# Altium schematic sheet 电源小板.SchDoc
size A4
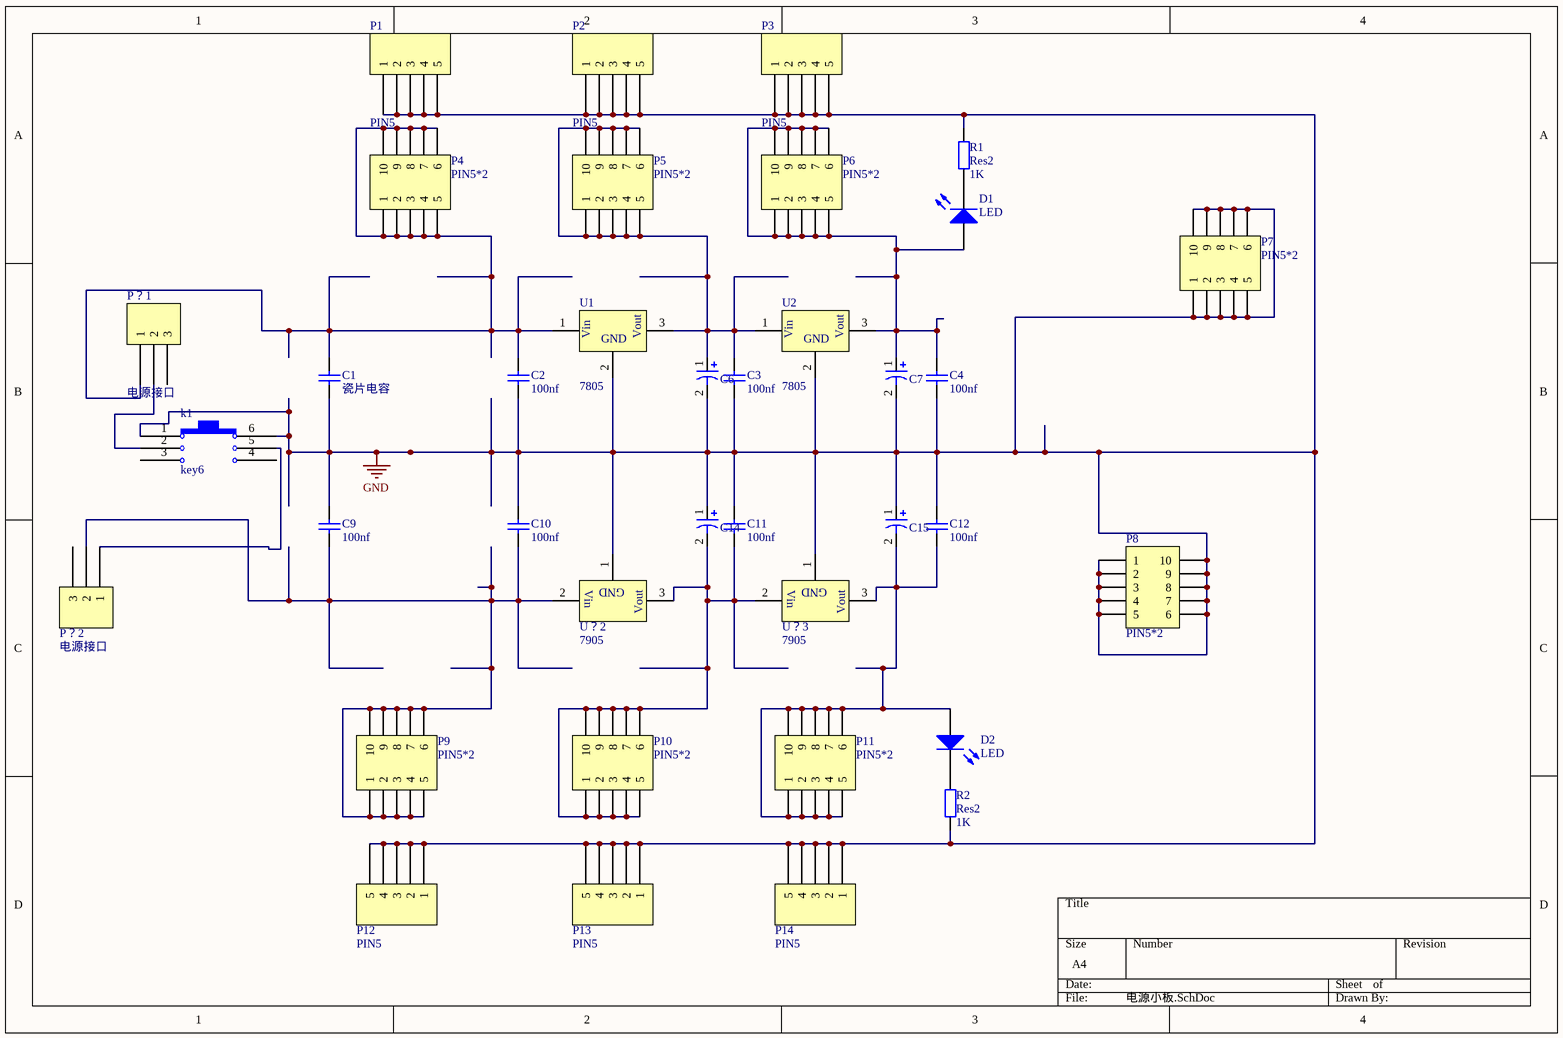
[diagram p0: 电源小板.SchDoc]

## Parts
C1  瓷片电容  [PIN 2]
C2  100nf  [C瓷片电容]
C3  100nf  [C瓷片电容]
C4  100nf  [C瓷片电容]
C6  C电解电容  [C (10,100,330UF)]  (value not drawn)
C7  C电解电容  [C (10,100,330UF)]  (value not drawn)
C9  100nf  [C瓷片电容]
C10  100nf  [C瓷片电容]
C11  100nf  [C瓷片电容]
C12  100nf  [C瓷片电容]
C14  C电解电容  [C (10,100,330UF)]  (value not drawn)
C15  C电解电容  [C (10,100,330UF)]  (value not drawn)
D1  LED  [LED]
D2  LED  [LED]
k1  key6  [key6]
P1  PIN5  [PIN5]
P2  PIN5  [PIN5]
P3  PIN5  [PIN5]
P4  PIN5*2  [PIN5*2]
P5  PIN5*2  [PIN5*2]
P6  PIN5*2  [PIN5*2]
P7  PIN5*2  [PIN5*2]
P8  PIN5*2  [PIN5*2]
P9  PIN5*2  [PIN5*2]
P10  PIN5*2  [PIN5*2]
P11  PIN5*2  [PIN5*2]
P12  PIN5  [PIN5]
P13  PIN5  [PIN5]
P14  PIN5  [PIN5]
P？1  电源接口  [电源接口]
P？2  电源接口  [电源接口]
R1  Res2  value 1K  [AXIAL-0.4]
R2  Res2  value 1K  [AXIAL-0.4]
U1  7805  [7805]
U2  7805  [7805]
U？2  7905  [7805]
U？3  7905  [7805]

## Nets
GND: C1.1 C2.1 C3.1 C4.1 C6.2 C7.2 C9.2 C10.2 C11.2 C12.2 C14.1 C15.1 k1.1 k1.6 P1.1 P1.2 P1.3 P1.4 P1.5 P2.1 P2.2 P2.3 P2.4 P2.5 P3.1 P3.2 P3.3 P3.4 P3.5 P7.1 P7.2 P7.3 P7.4 P7.5 P7.6 P7.7 P7.8 P7.9 P7.10 P8.1 P8.2 P8.3 P8.4 P8.5 P8.6 P8.7 P8.8 P8.9 P8.10 P12.1 P12.2 P12.3 P12.4 P12.5 P13.1 P13.2 P13.3 P13.4 P13.5 P14.1 P14.2 P14.3 P14.4 P14.5 R1.2 R2.1 U1.2(gnd) U2.2(gnd) U？2.1(gnd) U？3.1(gnd)
NetC1_2: C1.2 C2.2 P4.1 P4.2 P4.3 P4.4 P4.5 P4.6 P4.7 P4.8 P4.9 P4.10 P？1.1 U1.1(Vin)
NetC3_2: C3.2 C6.1 P5.1 P5.2 P5.3 P5.4 P5.5 P5.6 P5.7 P5.8 P5.9 P5.10 U1.3(Vout) U2.1(Vin)
NetC4_2: C4.2 C7.1 D1.1(A) P6.1 P6.2 P6.3 P6.4 P6.5 P6.6 P6.7 P6.8 P6.9 P6.10 U2.3(Vout)
NetC9_1: C9.1 C10.1 P9.1 P9.2 P9.3 P9.4 P9.5 P9.6 P9.7 P9.8 P9.9 P9.10 P？2.2 U？2.2(Vout)
NetC11_1: C11.1 C14.2 P10.1 P10.2 P10.3 P10.4 P10.5 P10.6 P10.7 P10.8 P10.9 P10.10 U？2.3(Vin) U？3.2(Vout)
NetC12_1: C12.1 C15.2 D2.1(A) P11.1 P11.2 P11.3 P11.4 P11.5 P11.6 P11.7 P11.8 P11.9 P11.10 U？3.3(Vin)
NetD1_2: D1.2(K) R1.1
NetD2_2: D2.2(K) R2.2
Netk1_2: k1.2 P？1.2
Netk1_5: k1.5 P？2.1

Not connected (* = marked no-connect by the designer): k1 3 4; P？1 3; P？2 3

## Notes on the sheet
- (in symbol 7805) GND
- (in symbol 7905) GND

## Library data of the parts
C2-C4 C9-C12 = C电容
R1 R2 = Res2: Resistor; Published: 8-Jun-2000; LatestRevisionDate: 17-Jul-2002; LatestRevisionNote: Re-released for DXP Platform.; PackageReference: AXIAL-0.4; Publisher: Altium Limited